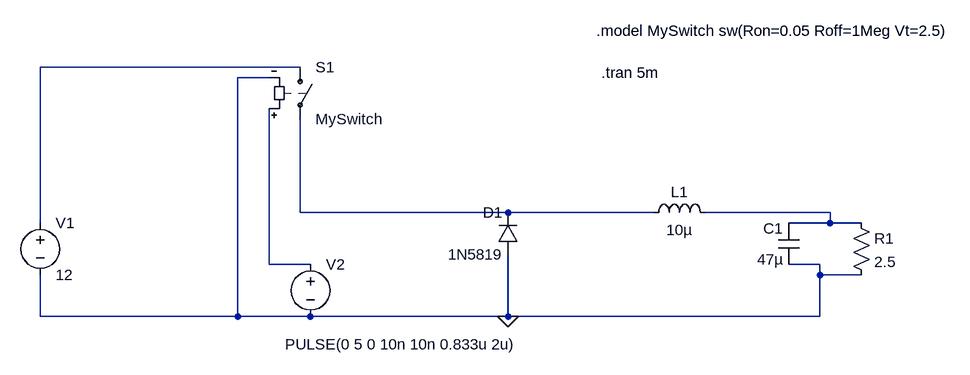
[diagram p0: schematic buck_converter.asc]
buck_converter.asc, the LTspice schematic file:
Version 4.1
SHEET 1 1420 680
WIRE 368 112 -32 112
WIRE 320 128 272 128
WIRE 368 336 368 192
WIRE 688 336 368 336
WIRE 912 336 688 336
WIRE 1184 336 992 336
WIRE -32 352 -32 112
WIRE 1184 352 1184 336
WIRE 1184 352 1120 352
WIRE 1232 352 1184 352
WIRE 320 416 320 176
WIRE 384 416 320 416
WIRE 1168 416 1120 416
WIRE 1168 432 1168 416
WIRE 1232 432 1168 432
WIRE -32 496 -32 432
WIRE 272 496 272 128
WIRE 272 496 -32 496
WIRE 384 496 272 496
WIRE 688 496 688 400
WIRE 688 496 384 496
WIRE 1168 496 1168 432
WIRE 1168 496 688 496
FLAG 688 496 0
SYMBOL voltage -32 336 R0
SYMATTR InstName V1
SYMATTR Value 12
SYMBOL voltage 384 400 R0
WINDOW 3 -39 139 Left 2
WINDOW 123 0 0 Left 0
WINDOW 39 0 0 Left 0
SYMATTR InstName V2
SYMATTR Value PULSE(0 5 0 10n 10n 0.833u 2u)
SYMBOL diode 704 400 R180
WINDOW 0 24 64 Left 2
WINDOW 3 24 0 Left 2
SYMATTR InstName D1
SYMATTR Value 1N5819
SYMATTR Description Diode
SYMATTR Type diode
SYMBOL res 1216 336 R0
SYMATTR InstName R1
SYMATTR Value 2.5
SYMBOL sw 368 96 R0
SYMATTR InstName S1
SYMATTR Value MySwitch
SYMBOL ind 896 352 R270
WINDOW 0 32 56 VTop 2
WINDOW 3 5 56 VBottom 2
SYMATTR InstName L1
SYMATTR Value 10µ
SYMATTR SpiceLine Rser=1m
SYMBOL cap 1136 416 R180
WINDOW 0 24 56 Left 2
WINDOW 3 24 8 Left 2
SYMATTR InstName C1
SYMATTR Value 47µ
TEXT 824 56 Left 2 !.model MySwitch sw(Ron=0.05 Roff=1Meg Vt=2.5)
TEXT 832 120 Left 2 !.tran 5m

The netlist it stands for:
* buck_converter.asc
V1 N001 0 12
V2 N004 0 PULSE(0 5 0 10n 10n 0.833u 2u)
D1 0 N002 1N5819
R1 N003 0 2.5
S1 N001 N002 N004 0 MySwitch
L1 N002 N003 10µ Rser=1m
C1 0 N003 47µ
.model D D
.lib standard.dio
.model MySwitch sw(Ron=0.05 Roff=1Meg Vt=2.5)
.tran 5m
.backanno
.end